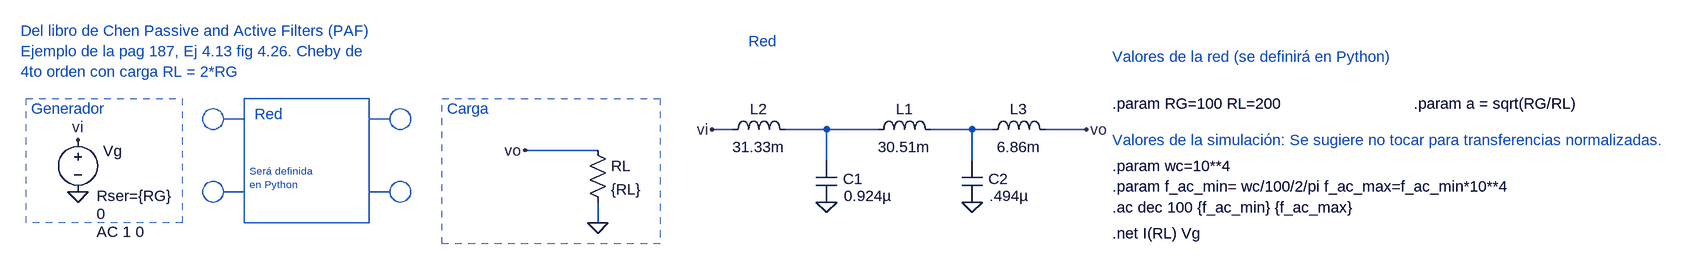
[diagram p0: schematic spar chen PAF butter 5 Ej 4.12 fig 4.22.asc]
spar chen PAF butter 5 Ej 4.12 fig 4.22.asc, the LTspice schematic file:
Version 4
SHEET 1 1884 872
WIRE -160 144 -192 144
WIRE -16 144 -80 144
WIRE 64 144 -16 144
WIRE 208 144 144 144
WIRE 240 144 208 144
WIRE 384 144 320 144
WIRE -368 176 -480 176
WIRE -16 192 -16 144
WIRE 208 192 208 144
WIRE -368 288 -368 256
FLAG -1168 240 0
FLAG -16 256 0
FLAG -368 288 0
FLAG -1168 160 vi
FLAG -480 176 vo
FLAG 384 144 vo
FLAG 208 256 0
FLAG -192 144 vi
SYMBOL voltage -1168 144 R0
WINDOW 3 29 130 Left 2
WINDOW 123 29 158 Left 2
WINDOW 39 29 102 Left 2
WINDOW 0 39 33 Left 2
SYMATTR Value 0
SYMATTR Value2 AC 1 0
SYMATTR SpiceLine Rser={RG}
SYMATTR InstName Vg
SYMBOL res -384 160 R0
SYMATTR InstName RL
SYMATTR Value {RL}
SYMBOL cap -32 192 R0
WINDOW 0 41 28 Left 2
WINDOW 3 43 54 Left 2
SYMATTR InstName C1
SYMATTR Value 0.924µ
SYMBOL ind -176 160 R270
WINDOW 0 32 56 VTop 2
WINDOW 3 5 56 VBottom 2
SYMATTR InstName L2
SYMATTR Value 31.33m
SYMBOL cap 192 192 R0
WINDOW 0 41 28 Left 2
WINDOW 3 43 54 Left 2
SYMATTR InstName C2
SYMATTR Value .494µ
SYMBOL ind 48 160 R270
WINDOW 0 32 56 VTop 2
WINDOW 3 5 56 VBottom 2
SYMATTR InstName L1
SYMATTR Value 30.51m
SYMBOL ind 224 160 R270
WINDOW 0 32 56 VTop 2
WINDOW 3 5 56 VBottom 2
SYMATTR InstName L3
SYMATTR Value 6.86m
TEXT 424 304 Left 2 !.net I(RL) Vg
TEXT -896 120 Left 2 ;Red
TEXT -1240 112 Left 2 ;Generador
TEXT -600 112 Left 2 ;Carga
TEXT -904 208 Left 1 ;Será definida \nen Python
TEXT 424 32 Left 2 ;Valores de la red (se definirá en Python)
TEXT 424 104 Left 2 !.param RG=100 RL=200
TEXT -1256 -8 Left 2 ;Del libro de Chen Passive and Active Filters (PAF)\nEjemplo de la pag 187, Ej 4.13 fig 4.26. Cheby de \n4to orden con carga RL = 2*RG
TEXT 424 160 Left 2 ;Valores de la simulación: Se sugiere no tocar para transferencias normalizadas.
TEXT -136 8 Left 2 ;Red
TEXT 888 104 Left 2 !.param a = sqrt(RG/RL)
TEXT 424 264 Left 2 !.ac dec 100 {f_ac_min} {f_ac_max}
TEXT 424 200 Left 2 !.param wc=10**4
TEXT 424 232 Left 2 !.param f_ac_min= wc/100/2/pi f_ac_max=f_ac_min*10**4
LINE Normal -912 128 -944 128
LINE Normal -912 240 -944 240
LINE Normal -720 240 -688 240
LINE Normal -720 128 -688 128
RECTANGLE Normal -720 288 -912 96
RECTANGLE Normal -1008 288 -1248 96 2
RECTANGLE Normal -272 320 -608 96 2
CIRCLE Normal -944 144 -976 112
CIRCLE Normal -944 256 -976 224
CIRCLE Normal -688 224 -656 256
CIRCLE Normal -688 112 -656 144

The netlist it stands for:
* spar chen PAF butter 5 Ej 4.12 fig 4.22.asc
Vg vi 0 0 AC 1 0 Rser={RG}
RL vo 0 {RL}
C1 N001 0 0.924µ
L2 vi N001 31.33m
C2 N002 0 .494µ
L1 N001 N002 30.51m
L3 N002 vo 6.86m
.net I(RL) Vg
* Red
* Generador
* Carga
* Será definida
* en Python
* Valores de la red (se definirá en Python)
.param RG=100 RL=200
* Del libro de Chen Passive and Active Filters (PAF)
* Ejemplo de la pag 187, Ej 4.13 fig 4.26. Cheby de
* 4to orden con carga RL = 2*RG
* Valores de la simulación: Se sugiere no tocar para transferencias normalizadas.
* Red
.param a = sqrt(RG/RL)
.ac dec 100 {f_ac_min} {f_ac_max}
.param wc=10**4
.param f_ac_min= wc/100/2/pi f_ac_max=f_ac_min*10**4
.backanno
.end

* Results of the author's LTspice run, read from the files saved beside the schematic
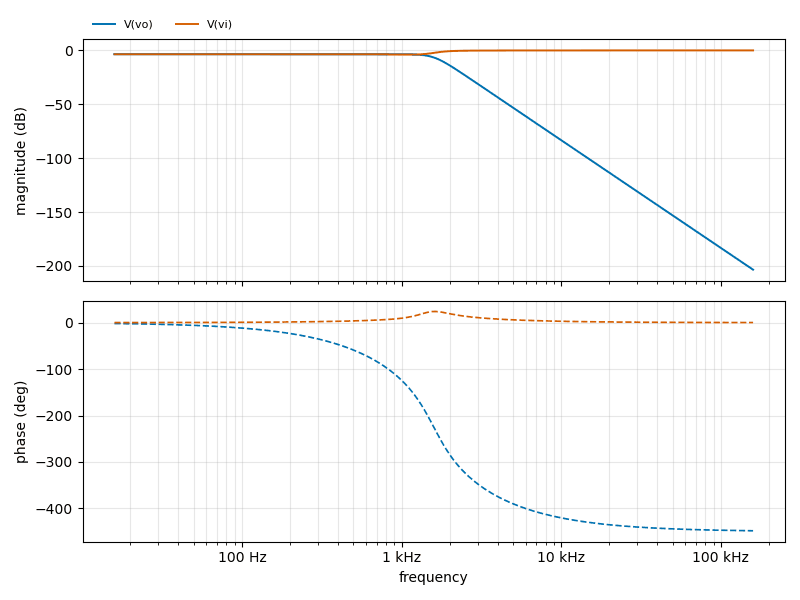
[diagram p1: AC Analysis of spar chen PAF butter 5 Ej 4.12 fig 4.22.asc, plotted from the saved traces]
* AC Analysis, 1 run:
*   V(vo): -3.52 dB at 15.92 Hz, -203.50 dB at 159.2 kHz, peak -3.52 dB at 15.92 Hz, 3 dB below the peak at 1.59 kHz
*   V(vi): -3.52 dB at 15.92 Hz, -0.00 dB at 159.2 kHz, peak -0.00 dB at 159.2 kHz, 3 dB below the peak at 1.47 kHz